# EAGLE design RaspBle (EAGLE 7.5.0)
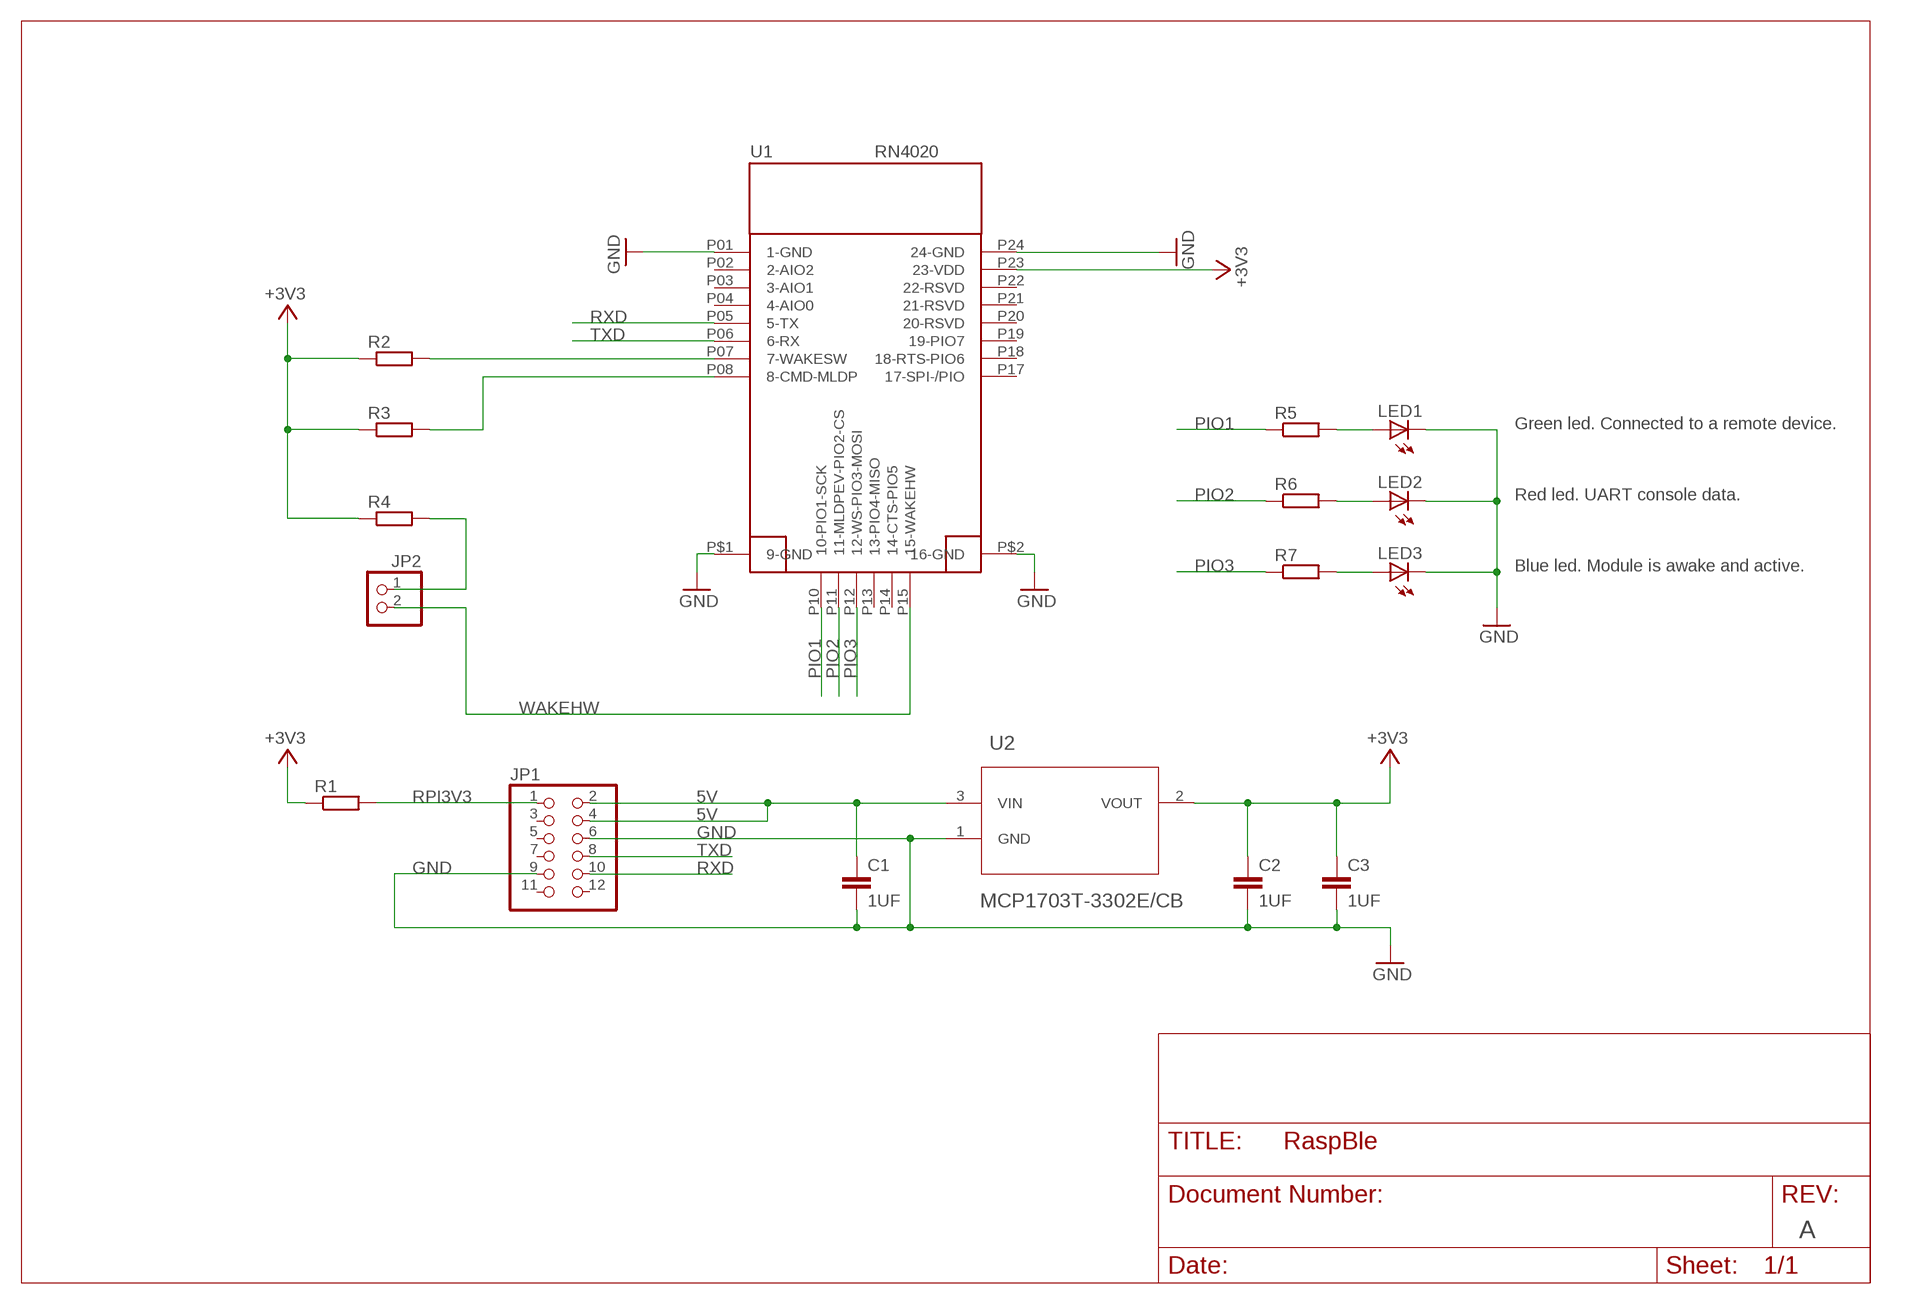
[diagram p0: schematic, sheet 1]

## Parts
C1  1UF  C-EUC1206  [C1206]
C2  1UF  C-EUC1206  [C1206]
C3  1UF  C-EUC1206  [C1206]
JP1  PINHD-2X6  [2X06]
JP2  PINHD-1X2  [1X02]
LED1  LEDSML1206  [SML1206]
LED2  LEDSML1206  [SML1206]
LED3  LEDSML1206  [SML1206]
R1  R-EU_R1206  [R1206]
R2  R-EU_R1206  [R1206]
R3  R-EU_R1206  [R1206]
R4  R-EU_R1206  [R1206]
R5  R-EU_R1206  [R1206]
R6  R-EU_R1206  [R1206]
R7  R-EU_R1206  [R1206]
U1  RN4020  [RN4020SMD]
U2  MCP1703T-3302E/CB  [SOT95P300X145-3N]

## Nets
5V: C1.1 JP1.2 JP1.4 U2.3(VIN)
+3V3: C2.1 C3.1 R1.1 R2.1 R3.1 R4.1 U1.P23(23-VDD) U2.2(VOUT)
GND: C1.2 C2.2 C3.2 JP1.6 JP1.9 LED1.C LED2.C LED3.C U1.P01(1-GND) U1.P24(24-GND) U1.P$1(9-GND) U1.P$2(16-GND) U2.1(GND)
N$1: R2.2 U1.P07(7-WAKESW)
N$2: R3.2 U1.P08(8-CMD-MLDP)
N$7: JP2.1 R4.2
N$13: LED3.A R7.2
N$14: LED2.A R6.2
N$15: LED1.A R5.2
PIO1: R5.1 U1.P10(10-PIO1-SCK)
PIO2: R6.1 U1.P11(11-MLDPEV-PIO2-CS)
PIO3: R7.1 U1.P12(12-WS-PIO3-MOSI)
RPI3V3: JP1.1 R1.2
RXD: JP1.10 U1.P05(5-TX)
TXD: JP1.8 U1.P06(6-RX)
WAKEHW: JP2.2 U1.P15(15-WAKEHW)
Unconnected: JP1.3 JP1.5 JP1.7 JP1.11 JP1.12 U1.P02(2-AIO2) U1.P03(3-AIO1) U1.P04(4-AIO0) U1.P13(13-PIO4-MISO) U1.P14(14-CTS-PIO5) U1.P17(17-SPI-/PIO) U1.P18(18-RTS-PIO6) U1.P19(19-PIO7) U1.P20(20-RSVD) U1.P21(21-RSVD) U1.P22(22-RSVD)

## Notes on the sheet
- Green led. Connected to a remote device.
- Red led. UART console data.
- Blue led. Module is awake and active.
- A

## Library data of the parts
C1-C3 = resistor:C-EU: CAPACITOR, European symbol
JP1 = pinhead:PINHD-2X6: PIN HEADER
JP2 = pinhead:PINHD-1X2: PIN HEADER
LED1-LED3 = led:LED: LED OSRAM: - CHIPLED LG R971, LG N971, LY N971, LG Q971, LY Q971, LO R971, LY R971 LH N974, LH R974 LS Q976, LO Q976, LY Q976 LO Q996 - Hyper CHIPLED LW Q18S LB Q993, LB Q99A, LB R99A - SideLED LS A670, LO A670, LY A670, LG A670, LP A670 LB A673, LV A673, LT A673, LW A673 LH A674 LY A675 LS A676, LA A676, LO A676, LY A676, LW A676 LS A679, LY A679, LG A679 - Hyper Micro SIDELED® LS Y876, LA Y876, LO Y876, LY Y876 LT Y87S - SmartLED LW L88C, LW L88S LB L89C, LB L89S, LG L890 LS L89K, LO L89K, LY L89K LS L896, LA L896, LO L896, LY L896 - TOPLED LS T670, LO T670, LY T670, LG T670, LP T670 LSG T670, LSP T670, LSY T670, LOP T670, LYG T670 LG T671, LOG T671, LSG T671 LB T673, LV T673, LT T673, LW T673 LH T674 LS T676, LA T676, LO T676, LY T676, LB T676, LH T676, LSB T676, LW T676 LB T67C, LV T67C, LT T67C, LS T67K, LO T67K, LY T67K, LW E67C LS E67B, LA E67B, LO E67B, LY E67B, LB E67C, LV E67C, LT E67C LW T67C LS T679, LY T679, LG T679 LS T770, LO T770, LY T770, LG T770, LP T770 LB T773, LV T773, LT T773, LW T773 LH T774 LS E675, LA E675, LY E675, LS T675 LS T776, LA T776, LO T776, LY T776, LB T776 LHGB T686 LT T68C, LB T68C - Hyper Mini TOPLED® LB M676 - Mini TOPLED Santana® LG M470 LS M47K, LO M47K, LY M47K Source: http://www.osram.convergy.de LUXEON: - LUMILED® LXK2-PW12-R00, LXK2-PW12-S00, LXK2-PW14-U00, LXK2-PW14-V00 LXK2-PM12-R00, LXK2-PM12-S00, LXK2-PM14-U00 LXK2-PE12-Q00, LXK2-PE12-R00, LXK2-PE12-S00, LXK2-PE14-T00, LXK2-PE14-U00 LXK2-PB12-K00, LXK2-PB12-L00, LXK2-PB12-M00, LXK2-PB14-N00, LXK2-PB14-P00, LXK2-PB14-Q00 LXK2-PR12-L00, LXK2-PR12-M00, LXK2-PR14-Q00, LXK2-PR14-R00 LXK2-PD12-Q00, LXK2-PD12-R00, LXK2-PD12-S00 LXK2-PH12-R00, LXK2-PH12-S00 LXK2-PL12-P00, LXK2-PL12-Q00, LXK2-PL12-R00 Source: www.luxeon.com KINGBRIGHT: KA-3528ASYC Source: www.kingbright.com
R1-R7 = resistor:R-EU_: RESISTOR, European symbol
U1 = microchip_bluetooth_v101_esanblesensor:RN4020
U2 = Microchip-MCP1703T-3302E-CB:MCP1703T-3302E/CB: Low Quiescent Current LDO Regulator; MPN: MCP1703T-3302E/CB; OC_FARNELL: 1439518; OC_NEWARK: 40M0637; PACKAGE: SOT-3; SUPPLIER: Microchip

## Board
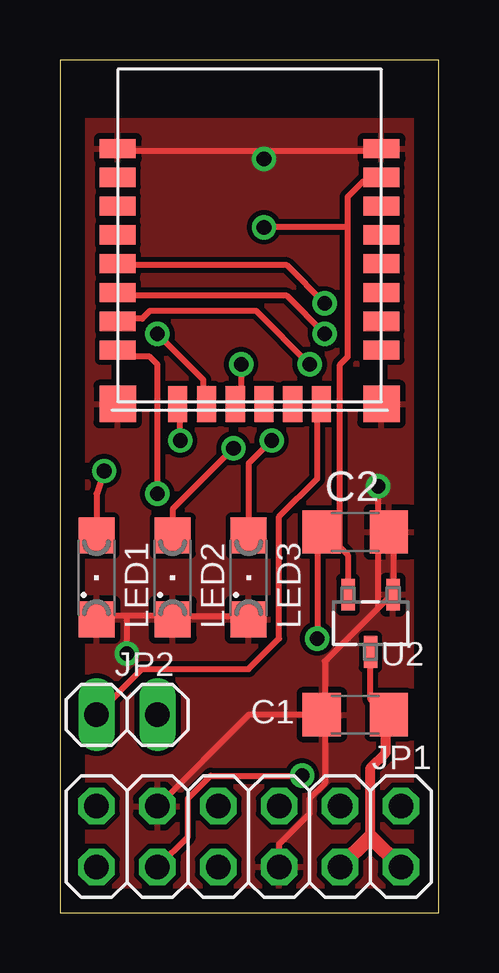
[diagram p1: board, top side]
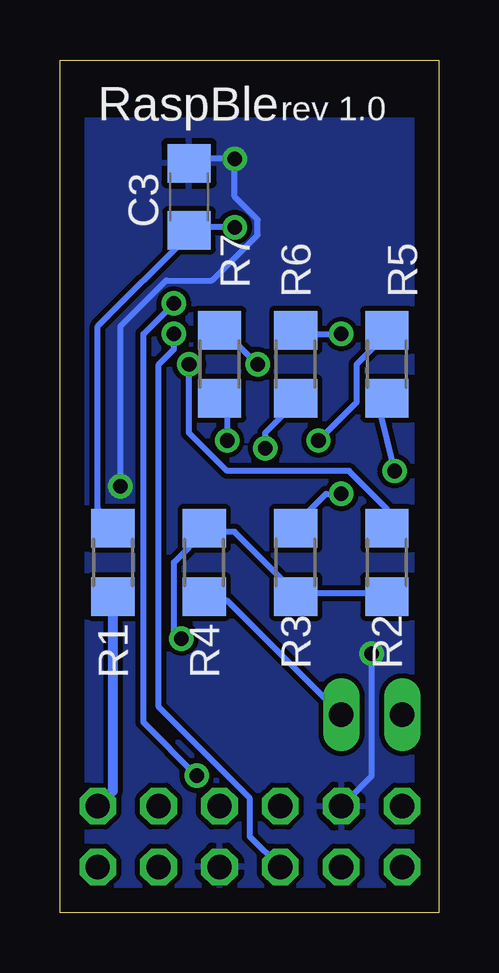
[diagram p2: board, bottom side, seen from below]

Size 15.8 x 35.55 mm. Coordinates in mm from the lower left corner, seen from the top.
Outline: 0,0 15.8,0 15.8,35.55 0,35.55 0,0
Copper layers (1*16): Top 0.035mm / dielectric 1.5mm / Bottom 0.035mm
Design rules "default": minimum track width 10mil, minimum drill 24mil, track to track 8mil, track to pad 8mil, pad to pad 8mil, via to via 8mil, smd to smd 8mil, copper to edge 40mil, drill to drill 8mil, minimum pad ring 10mil, minimum via ring 8mil, stop-mask expansion 4mil, vias tented up to drill 0mil, thermal gap 10mil

### Footprints (pad centres in the part's own frame; a part is rotated, then mirrored left to right if it is on the bottom)
C1206 = smd 1.6 x 1.8: 1 -1.4,0; 2 1.4,0
2X06 = drill 1.016 octagon: 1 -6.35,-1.27; 2 -6.35,1.27; 3 -3.81,-1.27; 4 -3.81,1.27; 5 -1.27,-1.27; 6 -1.27,1.27; 7 1.27,-1.27; 8 1.27,1.27; 9 3.81,-1.27; 10 3.81,1.27; 11 6.35,-1.27; 12 6.35,1.27
1X02 = drill 1.016 long: 1 -1.27,0; 2 1.27,0
SML1206 = smd 1.5 x 1.5: A 1.75,0; C -1.75,0
R1206 = smd 1.6 x 1.803: 1 -1.422,0; 2 1.422,0
RN4020SMD = smd 1.5 x 0.8: P01 0.25,10.9; P02 0.25,9.7; P03 0.25,8.5; P04 0.25,7.3; P05 0.25,6.1; P06 0.25,4.9; P07 0.25,3.7; P08 0.25,2.5; P17 11.25,2.5; P18 11.25,3.7; P19 11.25,4.9; P20 11.25,6.1; P21 11.25,7.3; P22 11.25,8.5; P23 11.25,9.7; P24 11.25,10.9 | smd 0.8 x 1.5: P10 2.75,0.25; P11 3.95,0.25; P12 5.15,0.25; P13 6.35,0.25; P14 7.55,0.25; P15 8.75,0.25 | smd 1.524 x 1.524: P$1 0.254,0.254; P$2 11.252,0.254
SOT95P300X145-3N = smd 0.559 x 1.321: 1 -0.94,-1.194; 2 0.94,-1.194; 3 0,1.194

### Placement (x,y rotation side)
C1  12.32,8.26 180 top
C2  12.32,15.88 0 top
C3  10.41,29.84 90 bottom
JP1  7.87,3.17 180 top
JP2  2.79,8.26 180 top
LED1  1.52,13.97 90 top
LED2  4.7,13.97 90 top
LED3  7.87,13.97 90 top
R1  13.59,14.61 270 bottom
R2  2.16,14.61 90 bottom
R3  5.97,14.61 90 bottom
R4  9.78,14.61 270 bottom
R5  2.16,22.86 270 bottom
R6  5.97,22.86 270 bottom
R7  9.14,22.86 270 bottom
U1  2.16,20.95 0 top
U2  12.95,12.06 180 top

### Tracks (layer width: path | path; a pad name or v marks a point on that pad's centre or on a via)
5V
  Top 0.254: U2.3 12.95,8.89 13.59,8.26 C1.1
  Top 0.406: 13.59,8.26 13.59,6.67 12.95,6.03 12.95,3.17
  Top 0.61: JP1.4 12.95,3.17 JP1.2
+3V3  (via drill 0.61)
  Top 0.254: 11.68,15.24 11.05,15.88 C2.1 | 11.68,15.24 12,14.92 12,13.34 U2.2 | 12,28.57 12,23.18 11.68,22.86 11.68,15.24 | 12,28.57 12,29.84 12.64,30.48 13.27,30.48 U1.P23 | 11.68,15.24 C2.1 | v10.73,11.43 10.73,15.88 C2.1 | 12,28.57 v8.51,28.57
  Bottom 0.254: R1.1 13.59,16.19 14.22,16.83 14.22,24.45 10.41,28.26 C3.1 10.41,28.57 v8.51,28.57 | 5.97,13.34 2.16,13.34 R2.1 | 9.78,15.88 8.51,15.88 5.97,13.34 | 5.97,13.34 R3.1 | 9.78,15.88 11.05,14.61 11.05,11.75 v10.73,11.43 | 9.78,15.88 R4.1
GND  (via drill 0.61)
  Top 0.254: 8.51,31.75 13.27,31.75 U1.P24 | 8.51,31.75 2.48,31.75 U1.P01 | 8.51,31.75 v8.51,31.43 | 4.7,12.38 2.79,12.38 | 2.79,12.38 1.52,12.38 LED1.C | 4.7,12.38 7.87,12.38 LED3.C | 4.7,12.38 LED2.C | 13.91,13.34 13.91,15.88 C2.2 | 11.05,8.26 11.05,10.48 13.27,12.7 | 13.91,13.34 13.27,12.7 | 13.91,13.34 U2.1 | JP1.9 7.87,8.26 C1.2 11.05,8.26 | JP1.6 9.14,2.86 10.41,4.13 10.41,4.76 11.05,5.4 11.05,8.26 | v2.79,10.79 2.79,12.38 | 13.27,12.7 v13.27,17.78
  Bottom 0.254: C3.2 10.41,31.43 v8.51,31.43 8.51,29.84 7.56,28.89 7.56,28.26 9.46,26.35 11.37,26.35 13.27,24.45 v13.27,17.78 | v2.79,10.79 2.79,5.71 JP1.9
  pour Top: 0,33.02 16,33.02 16,0 0,0
  pour Bottom: 0,33.02 16,33.02 16,0 0.25,0
N$1  (via drill 0.61)
  Top 0.254: v10.41,22.86 8.19,25.08 3.75,25.08 3.43,24.77 2.48,24.77 U1.P07
  Bottom 0.254: v10.41,22.86 10.41,20 8.83,18.41 3.75,18.41 2.16,16.83 R2.2
N$2  (via drill 0.61)
  Top 0.254: v4.06,17.46 4.06,22.86 3.75,23.18 2.48,23.18 U1.P08
  Bottom 0.254: v4.06,17.46 4.7,17.46 5.97,16.19 R3.2
N$7
  Bottom 0.254: JP2.1 8.83,13.02 9.78,13.02 R4.2
N$13  (via drill 0.61)
  Top 0.254: LED3.A 7.87,18.73 v8.83,19.68
  Bottom 0.254: v8.83,19.68 8.83,20.95 9.14,21.27 R7.2
N$14  (via drill 0.61)
  Top 0.254: LED2.A 4.7,16.83 v7.24,19.37
  Bottom 0.254: v7.24,19.37 7.24,20 5.97,21.27 R6.2
N$15  (via drill 0.61)
  Top 0.254: LED1.A 1.52,17.46 v1.84,18.41
  Bottom 0.254: v1.84,18.41 2.48,20.95 2.16,21.27 R5.2
PIO1  (via drill 0.61)
  Top 0.254: v5.02,19.68 5.02,20.95 U1.P10
  Bottom 0.254: v5.02,19.68 3.43,21.27 3.43,22.86 2.16,24.13 R5.1
PIO2  (via drill 0.61)
  Top 0.254: v4.06,24.13 5.97,22.23 5.97,21.27 U1.P11
  Bottom 0.254: v4.06,24.13 5.97,24.13 R6.1
PIO3  (via drill 0.61)
  Top 0.254: v7.56,22.86 7.56,21.27 U1.P12
  Bottom 0.254: v7.56,22.86 9.14,24.45 R7.1
RPI3V3
  Bottom 0.406: R1.2 13.59,5.08 JP1.1
RXD  (via drill 0.61)
  Top 0.254: v11.05,25.4 9.46,26.99 2.48,26.99 U1.P05 | v10.1,5.71 6.29,5.71 5.33,4.76 5.33,3.17 JP1.10
  Bottom 0.254: v11.05,25.4 12.32,24.13 12.32,7.94 v10.1,5.71
TXD  (via drill 0.61)
  Top 0.254: v11.05,24.13 9.46,25.72 2.48,25.72 U1.P06
  Bottom 0.254: v11.05,24.13 11.05,23.5 11.68,22.86 11.68,8.57 7.87,4.76 7.87,3.17 JP1.8
WAKEHW
  Top 0.254: JP2.2 3.43,10.16 7.87,10.16 9.14,11.43 9.14,16.51 10.73,18.1 10.73,20.95 U1.P15

### Text on the board
bNames: rev 1.0 | RaspBle